# Altium schematic sheet PCA9685.SchDoc
size A4
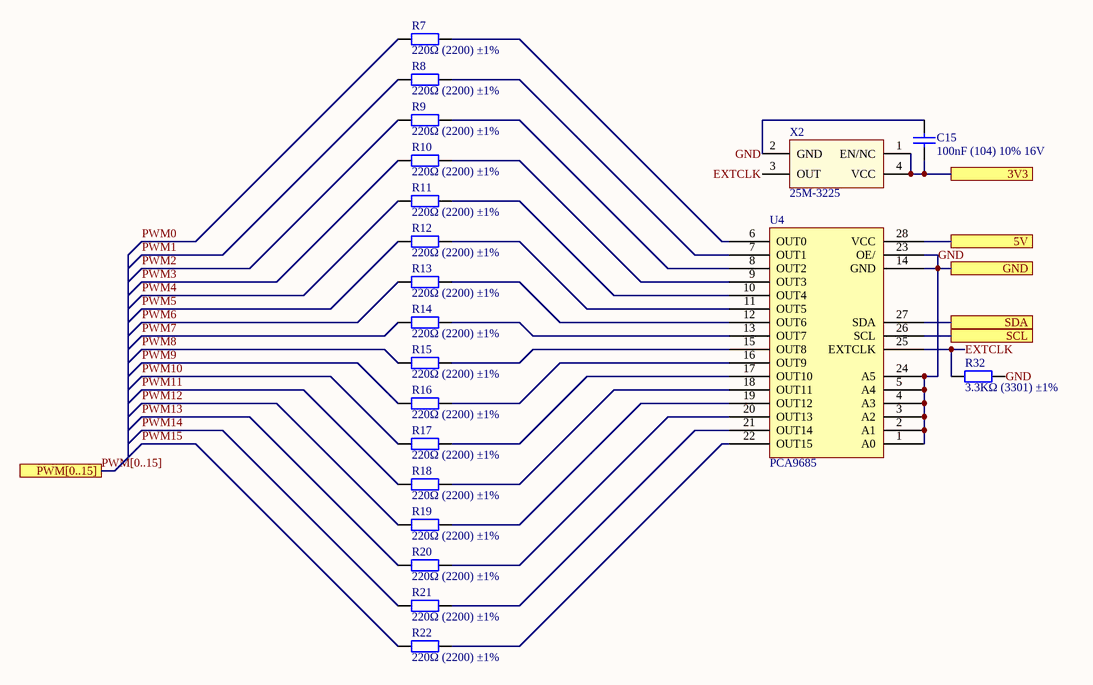
[diagram p0: PCA9685.SchDoc]

## Parts
C15  100nF (104) 10% 16V  [0402_C]
R7  220Ω (2200) ±1%  [0402_R]
R8  220Ω (2200) ±1%  [0402_R]
R9  220Ω (2200) ±1%  [0402_R]
R10  220Ω (2200) ±1%  [0402_R]
R11  220Ω (2200) ±1%  [0402_R]
R12  220Ω (2200) ±1%  [0402_R]
R13  220Ω (2200) ±1%  [0402_R]
R14  220Ω (2200) ±1%  [0402_R]
R15  220Ω (2200) ±1%  [0402_R]
R16  220Ω (2200) ±1%  [0402_R]
R17  220Ω (2200) ±1%  [0402_R]
R18  220Ω (2200) ±1%  [0402_R]
R19  220Ω (2200) ±1%  [0402_R]
R20  220Ω (2200) ±1%  [0402_R]
R21  220Ω (2200) ±1%  [0402_R]
R22  220Ω (2200) ±1%  [0402_R]
R32  3.3KΩ (3301) ±1%  [0402_R]
U4  PCA9685  [TSSOP28_M]
X2  25M-3225  [OSC 3225-4P]

## Ports
3V3, 5V, GND, PWM[0..15], SCL, SDA

## Nets
3V3: C15.1 X2.1(EN/NC) X2.4(VCC) ; port 3V3
5V: U4.28(VCC) ; port 5V
EXTCLK: R32.1 U4.25(EXTCLK) X2.3(OUT)
GND: C15.2 R32.2 U4.1(A0) U4.2(A1) U4.3(A2) U4.4(A3) U4.5(A4) U4.14(GND) U4.23(OE/) U4.24(A5) X2.2(GND) ; port GND
PWM0: R7.1
PWM1: R8.1
PWM2: R9.1
PWM3: R10.1
PWM4: R11.1
PWM5: R12.1
PWM6: R13.1
PWM7: R14.1
PWM8: R15.1
PWM9: R16.1
PWM10: R17.1
PWM11: R18.1
PWM12: R19.1
PWM13: R20.1
PWM14: R21.1
PWM15: R22.1
SCL: U4.26(SCL) ; port SCL
SDA: U4.27(SDA) ; port SDA
NetR7_2: R7.2 U4.6(OUT0)
NetR8_2: R8.2 U4.7(OUT1)
NetR9_2: R9.2 U4.8(OUT2)
NetR10_2: R10.2 U4.9(OUT3)
NetR11_2: R11.2 U4.10(OUT4)
NetR12_2: R12.2 U4.11(OUT5)
NetR13_2: R13.2 U4.12(OUT6)
NetR14_2: R14.2 U4.13(OUT7)
NetR15_2: R15.2 U4.15(OUT8)
NetR16_2: R16.2 U4.16(OUT9)
NetR17_2: R17.2 U4.17(OUT10)
NetR18_2: R18.2 U4.18(OUT11)
NetR19_2: R19.2 U4.19(OUT12)
NetR20_2: R20.2 U4.20(OUT13)
NetR21_2: R21.2 U4.21(OUT14)
NetR22_2: R22.2 U4.22(OUT15)

## Buses and harness runs
bus PWM[0..15] = port PWM[0..15]

## Library data of the parts
C15 = 0402 100nF (104) 10% 16V: 贴片电容; ComponentLink1Description: 供应商链接; ComponentLink1URL: http://www.szlcsc.com/product/details_1877.html; Package: 0402; Supplier: LC; SuppliersPartNumber: C1525
R7-R22 = 0402 220Ω (2200) 1%: 贴片电阻; ComponentLink1Description: 供应商链接; ComponentLink1URL: http://www.szlcsc.com/product/details_25834.html; Package: 0402; Supplier: LC; SuppliersPartNumber: C25091
R32 = 0402 3.3KΩ (3301) 1%: 贴片电阻; ComponentLink1Description: 供应商链接; ComponentLink1URL: http://www.szlcsc.com/product/details_26633.html; Package: 0402; Supplier: LC; SuppliersPartNumber: C25890
U4 = PCA9685: 16-channel, 12-bit PWM Fm+ I2C-bus LED controller
X2 = XTAL-ACT-4P: 4脚有源晶振; 版权归属: 源创客; BOM名称: 4脚有源晶振; 学习资源: www.ooocke.com